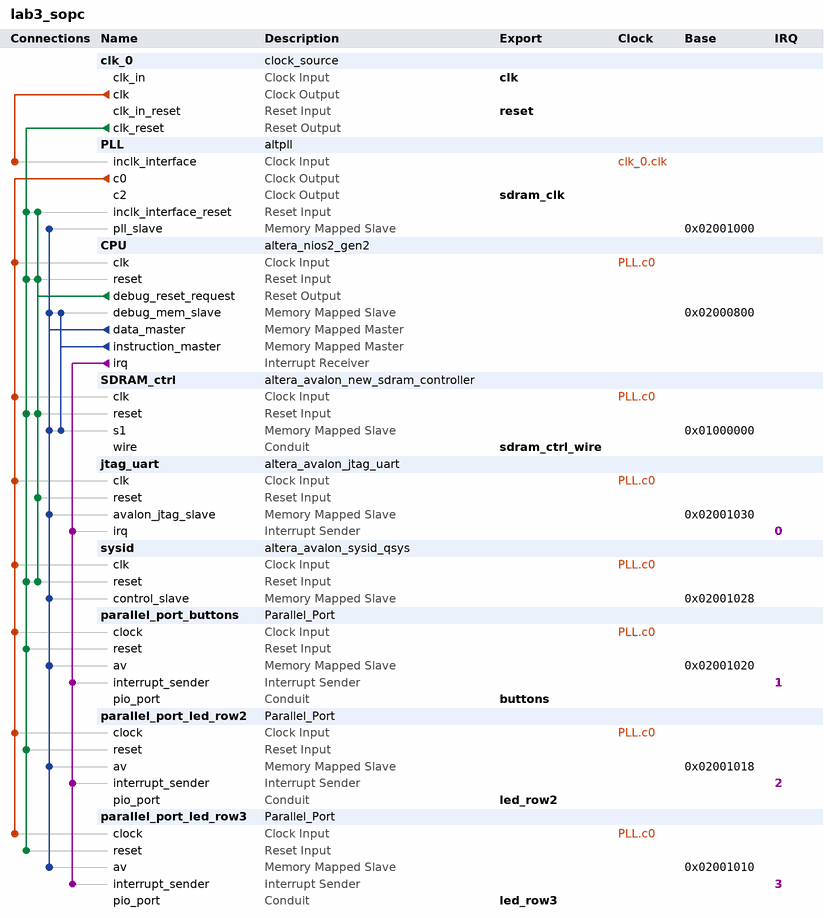
[diagram p0: system contents]
# Platform Designer (Qsys) system lab3_sopc, Cyclone IV E EP4CE30F23C7
# Parameters at their usual value, and those the tool derives, are not listed.
package require -exact qsys 18.1
create_system lab3_sopc
set_project_property DEVICE_FAMILY {Cyclone IV E}
set_project_property DEVICE EP4CE30F23C7

add_instance clk_0 clock_source 18.1
set_instance_parameter_value clk_0 clockFrequency 50000000

add_instance PLL altpll 18.1
set_instance_parameter_value PLL CLK0_DIVIDE_BY 1
set_instance_parameter_value PLL CLK0_MULTIPLY_BY 1
set_instance_parameter_value PLL CLK2_DIVIDE_BY 1
set_instance_parameter_value PLL CLK2_DUTY_CYCLE 50
set_instance_parameter_value PLL CLK2_MULTIPLY_BY 1
set_instance_parameter_value PLL CLK2_PHASE_SHIFT 0
set_instance_parameter_value PLL INCLK0_INPUT_FREQUENCY 20000
set_instance_parameter_value PLL PORT_ARESET PORT_UNUSED
set_instance_parameter_value PLL PORT_LOCKED PORT_UNUSED
set_instance_parameter_value PLL PORT_clk1 PORT_UNUSED
set_instance_parameter_value PLL PORT_clk2 PORT_USED
set_instance_parameter_value PLL PORT_clk3 PORT_UNUSED

add_instance CPU altera_nios2_gen2 18.1
set_instance_parameter_value CPU dcache_size 2048
set_instance_parameter_value CPU exceptionSlave SDRAM_ctrl.s1
set_instance_parameter_value CPU icache_size 4096
set_instance_parameter_value CPU impl Fast
set_instance_parameter_value CPU resetSlave SDRAM_ctrl.s1

add_instance SDRAM_ctrl altera_avalon_new_sdram_controller 18.1
set_instance_parameter_value SDRAM_ctrl TAC 5.5
set_instance_parameter_value SDRAM_ctrl TRCD 20.0
set_instance_parameter_value SDRAM_ctrl TRP 20.0
set_instance_parameter_value SDRAM_ctrl casLatency 3
set_instance_parameter_value SDRAM_ctrl columnWidth 9
set_instance_parameter_value SDRAM_ctrl dataWidth 16
set_instance_parameter_value SDRAM_ctrl generateSimulationModel false
set_instance_parameter_value SDRAM_ctrl model single_Micron_MT48LC4M32B2_7_chip
set_instance_parameter_value SDRAM_ctrl numberOfBanks 4
set_instance_parameter_value SDRAM_ctrl numberOfChipSelects 1
set_instance_parameter_value SDRAM_ctrl powerUpDelay 100.0
set_instance_parameter_value SDRAM_ctrl refreshPeriod 15.625
set_instance_parameter_value SDRAM_ctrl rowWidth 12

add_instance jtag_uart altera_avalon_jtag_uart 18.1
set_instance_parameter_value jtag_uart simInteractiveOptions NO_INTERACTIVE_WINDOWS

add_instance sysid altera_avalon_sysid_qsys 18.1
set_instance_parameter_value sysid id 12213761

add_instance parallel_port_buttons Parallel_Port 1.0

add_instance parallel_port_led_row2 Parallel_Port 1.0

add_instance parallel_port_led_row3 Parallel_Port 1.0

# connections
add_connection clk_0.clk PLL.inclk_interface clock
add_connection PLL.c0 CPU.clk clock
add_connection PLL.c0 jtag_uart.clk clock
add_connection PLL.c0 parallel_port_buttons.clock clock
add_connection PLL.c0 parallel_port_led_row2.clock clock
add_connection PLL.c0 parallel_port_led_row3.clock clock
add_connection PLL.c0 SDRAM_ctrl.clk clock
add_connection PLL.c0 sysid.clk clock
add_connection clk_0.clk_reset CPU.reset reset
add_connection clk_0.clk_reset parallel_port_buttons.reset reset
add_connection clk_0.clk_reset parallel_port_led_row2.reset reset
add_connection clk_0.clk_reset parallel_port_led_row3.reset reset
add_connection clk_0.clk_reset PLL.inclk_interface_reset reset
add_connection clk_0.clk_reset SDRAM_ctrl.reset reset
add_connection clk_0.clk_reset sysid.reset reset
add_connection CPU.debug_reset_request CPU.reset reset
add_connection CPU.debug_reset_request jtag_uart.reset reset
add_connection CPU.debug_reset_request PLL.inclk_interface_reset reset
add_connection CPU.debug_reset_request SDRAM_ctrl.reset reset
add_connection CPU.debug_reset_request sysid.reset reset
add_connection CPU.data_master CPU.debug_mem_slave avalon
set_connection_parameter_value CPU.data_master/CPU.debug_mem_slave baseAddress 0x02000800
add_connection CPU.data_master jtag_uart.avalon_jtag_slave avalon
set_connection_parameter_value CPU.data_master/jtag_uart.avalon_jtag_slave baseAddress 0x02001030
add_connection CPU.data_master parallel_port_buttons.av avalon
set_connection_parameter_value CPU.data_master/parallel_port_buttons.av baseAddress 0x02001020
add_connection CPU.data_master parallel_port_led_row2.av avalon
set_connection_parameter_value CPU.data_master/parallel_port_led_row2.av baseAddress 0x02001018
add_connection CPU.data_master parallel_port_led_row3.av avalon
set_connection_parameter_value CPU.data_master/parallel_port_led_row3.av baseAddress 0x02001010
add_connection CPU.data_master PLL.pll_slave avalon
set_connection_parameter_value CPU.data_master/PLL.pll_slave baseAddress 0x02001000
add_connection CPU.data_master SDRAM_ctrl.s1 avalon
set_connection_parameter_value CPU.data_master/SDRAM_ctrl.s1 baseAddress 0x01000000
add_connection CPU.data_master sysid.control_slave avalon
set_connection_parameter_value CPU.data_master/sysid.control_slave baseAddress 0x02001028
add_connection CPU.instruction_master CPU.debug_mem_slave avalon
set_connection_parameter_value CPU.instruction_master/CPU.debug_mem_slave baseAddress 0x02000800
add_connection CPU.instruction_master SDRAM_ctrl.s1 avalon
set_connection_parameter_value CPU.instruction_master/SDRAM_ctrl.s1 baseAddress 0x01000000
add_connection CPU.irq jtag_uart.irq interrupt
set_connection_parameter_value CPU.irq/jtag_uart.irq irqNumber 0
add_connection CPU.irq parallel_port_buttons.interrupt_sender interrupt
set_connection_parameter_value CPU.irq/parallel_port_buttons.interrupt_sender irqNumber 1
add_connection CPU.irq parallel_port_led_row2.interrupt_sender interrupt
set_connection_parameter_value CPU.irq/parallel_port_led_row2.interrupt_sender irqNumber 2
add_connection CPU.irq parallel_port_led_row3.interrupt_sender interrupt
set_connection_parameter_value CPU.irq/parallel_port_led_row3.interrupt_sender irqNumber 3

# exported interfaces
add_interface buttons conduit end
set_interface_property buttons EXPORT_OF parallel_port_buttons.pio_port
add_interface clk clock sink
set_interface_property clk EXPORT_OF clk_0.clk_in
add_interface led_row2 conduit end
set_interface_property led_row2 EXPORT_OF parallel_port_led_row2.pio_port
add_interface led_row3 conduit end
set_interface_property led_row3 EXPORT_OF parallel_port_led_row3.pio_port
add_interface reset reset sink
set_interface_property reset EXPORT_OF clk_0.clk_in_reset
add_interface sdram_clk clock source
set_interface_property sdram_clk EXPORT_OF PLL.c2
add_interface sdram_ctrl_wire conduit end
set_interface_property sdram_ctrl_wire EXPORT_OF SDRAM_ctrl.wire

set_interconnect_requirement {$system} qsys_mm.clockCrossingAdapter HANDSHAKE
set_interconnect_requirement {$system} qsys_mm.enableEccProtection FALSE
set_interconnect_requirement {$system} qsys_mm.insertDefaultSlave FALSE
set_interconnect_requirement {$system} qsys_mm.maxAdditionalLatency 1

save_system lab3_sopc.qsys
